# EAGLE design nRF-Remote (EAGLE 9.4.0)

## Sheet 1 of 2
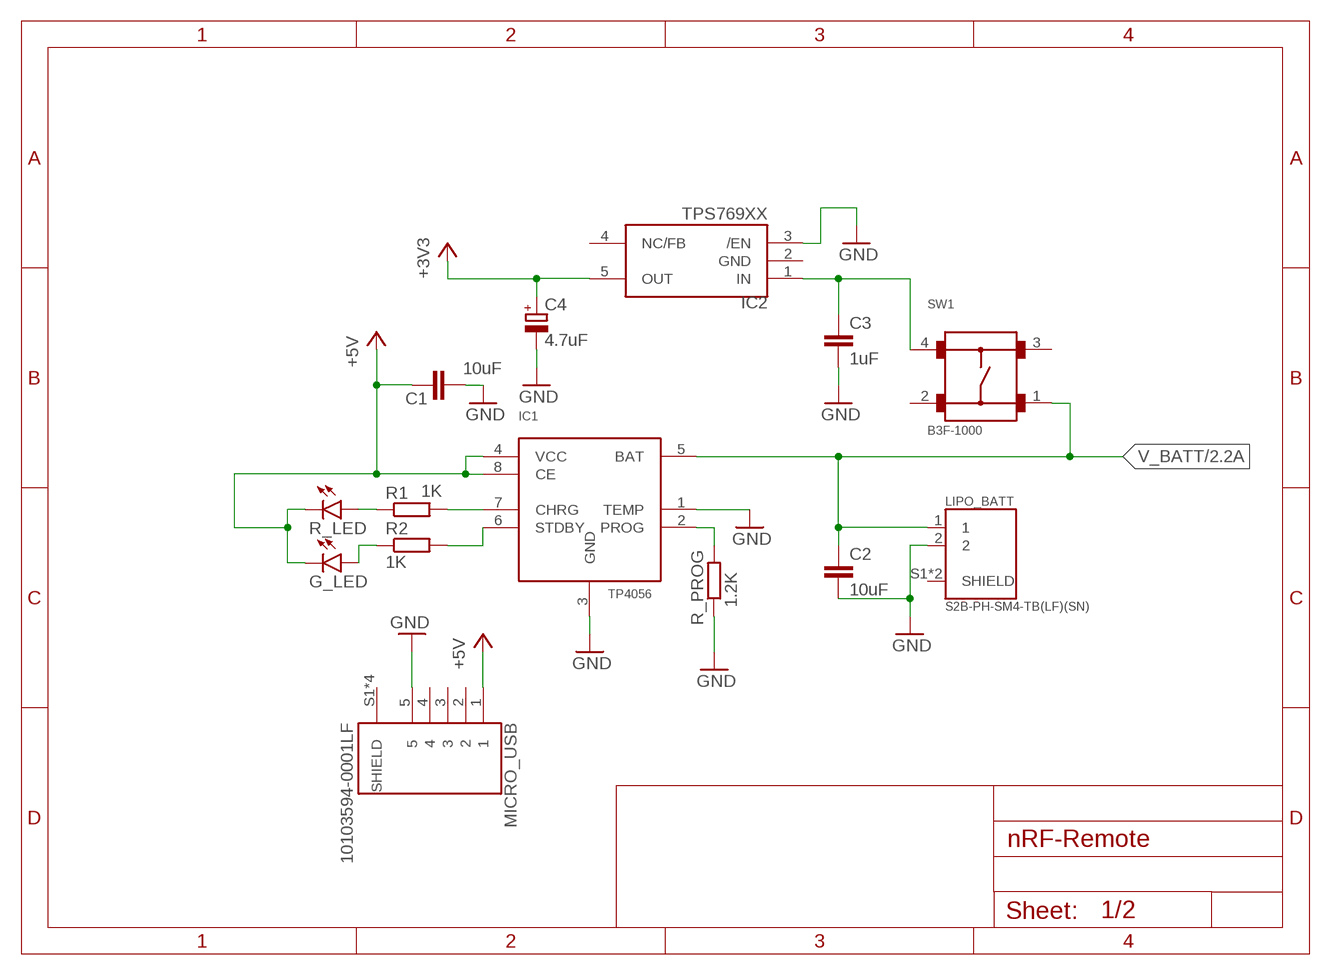
[diagram p0: schematic, sheet 1]

### Parts
C1  10uF  C-EUC0603  [C0603]
C2  10uF  C-EUC0603  [C0603]
C3  1uF  C-EUC0603  [C0603]
C4  4.7uF  CPOL-EU153CLV-0605  [153CLV-0605]
G_LED  LEDCHIP-LED0805  [CHIP-LED0805]
IC1  TP4056  [SOP-8]
IC2  TPS769XX  [SOT23-5L]
LIPO_BATT  S2B-PH-SM4-TB(LF)(SN)  [S2B-PH-SM4-TB(LF)(SN)]
MICRO_USB  10103594-0001LF  [10103594-0001LF]
R1  1K  R-EU_R0603  [R0603]
R2  1K  R-EU_R0603  [R0603]
R_LED  LEDCHIP-LED0805  [CHIP-LED0805]
R_PROG  1.2K  R-EU_R0603  [R0603]
SW1  B3F-1000  [B3F-1000]

### Nets
+3V3: C4.+ IC2.5(OUT) ; also sheet 2
+5V: C1.1 G_LED.C IC1.4(VCC) IC1.8(CE) MICRO_USB.1 R_LED.C
GND: C1.2 C2.2 C3.2 C4.- IC1.1(TEMP) IC1.3(GND) IC2.3(/EN) LIPO_BATT.2 MICRO_USB.5 R_PROG.1 ; also sheet 2
N$1: IC1.7(CHRG) R1.2
N$2: IC1.6(STDBY) R2.2
N$3: R1.1 R_LED.A
N$4: G_LED.A R2.1
N$6: IC1.2(PROG) R_PROG.2
N$7: C3.1 IC2.1(IN) SW1.4
V_BATT: C2.1 IC1.5(BAT) LIPO_BATT.1 SW1.1 ; also sheet 2
Unconnected: IC2.4(NC/FB) LIPO_BATT.S1(SHIELD) LIPO_BATT.S2(SHIELD) MICRO_USB.2 MICRO_USB.3 MICRO_USB.4 MICRO_USB.S1(SHIELD) MICRO_USB.S2(SHIELD) MICRO_USB.S3(SHIELD) MICRO_USB.S4(SHIELD) SW1.2 SW1.3

## Sheet 2 of 2
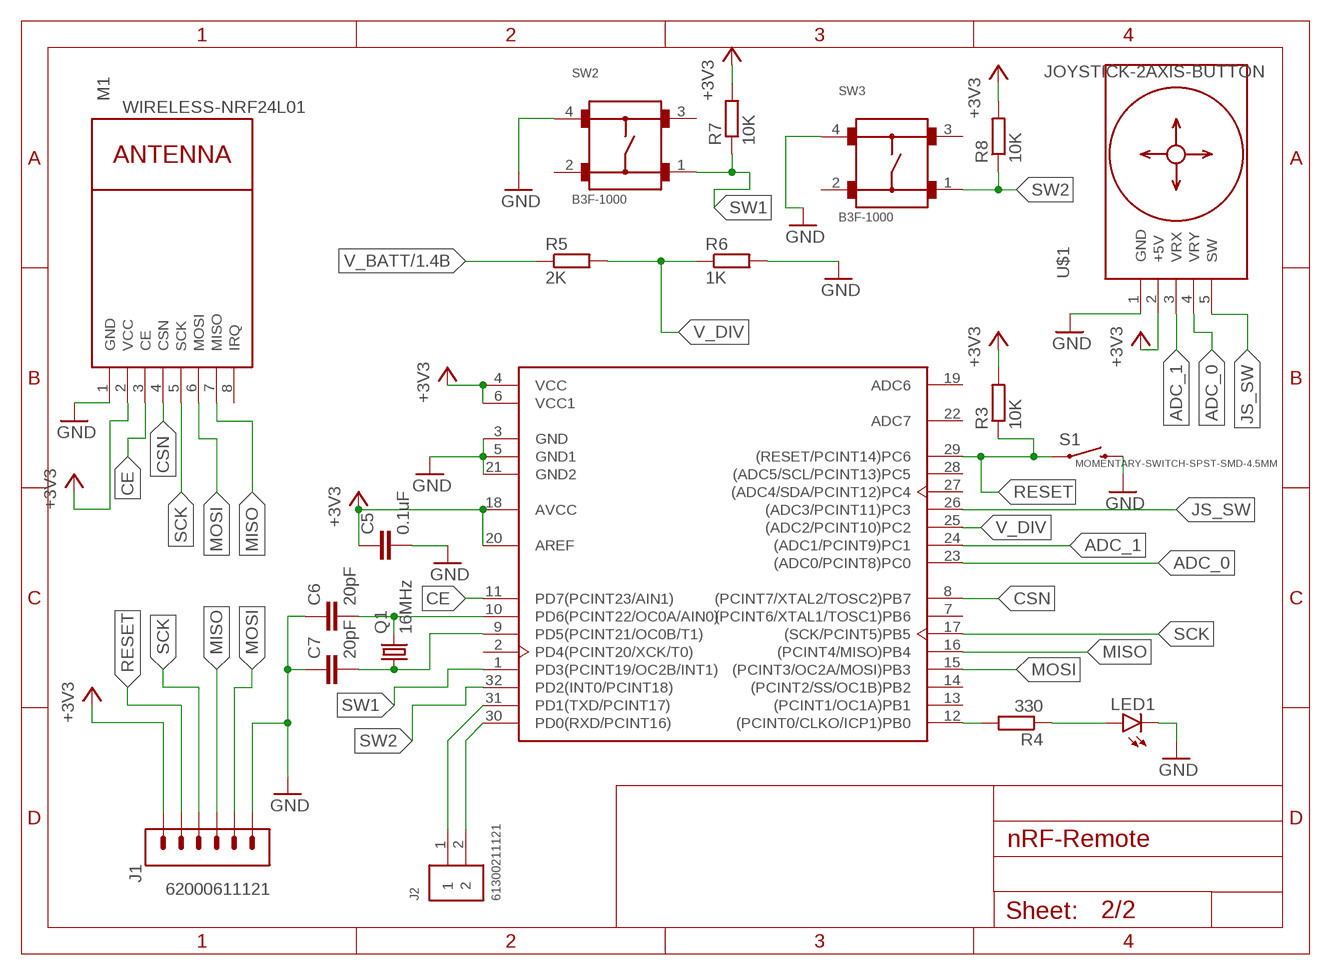
[diagram p1: schematic, sheet 2]

### Parts
C5  0.1uF  C-EUC0805  [C0805]
C6  20pF  C-EUC0603  [C0603]
C7  20pF  C-EUC0603  [C0603]
J1  62000611121  [62000611121]
J2  61300211121  [61300211121]
LED1  LEDCHIP-LED0805  [CHIP-LED0805]
M1  WIRELESS-NRF24L01  [WIRELESS-NRF24L01]
Q1  16MHz  CRYSTALSM49  [SM49]
R3  10K  R-EU_R0805  [R0805]
R4  330  R-EU_R0805  [R0805]
R5  2K  R-EU_R0805  [R0805]
R6  1K  R-EU_R0805  [R0805]
R7  10K  R-EU_R0603  [R0603]
R8  10K  R-EU_R0603  [R0603]
S1  MOMENTARY-SWITCH-SPST-SMD-4.5MM  [TACTILE_SWITCH_SMD_4.5MM]
SW2  B3F-1000  [B3F-1000]
SW3  B3F-1000  [B3F-1000]
U1  ATMEGA328P-AU  [TQFP-32]
U$1  JOYSTICK-2AXIS-BUTTON  [JOYSTICK-2AXIS-BUTTON]

### Nets
+3V3: C5.1 J1.1 M1.2(VCC) R3.2 R7.2 R8.2 U1.4(VCC) U1.6(VCC1) U1.18(AVCC) U1.20(AREF) U$1.2(+5V) ; also sheet 1
ADC_0: U1.23((ADC0/PCINT8)PC0) U$1.4(VRY)
ADC_1: U1.24((ADC1/PCINT9)PC1) U$1.3(VRX)
CE: M1.3(CE) U1.11(PD7(PCINT23/AIN1))
CSN: M1.4(CSN) U1.8((PCINT7/XTAL2/TOSC2)PB7)
GND: C5.2 C6.1 C7.1 J1.6 LED1.C M1.1(GND) R6.2 S1.1 S1.4 SW2.4 SW3.4 U1.3(GND) U1.5(GND1) U1.21(GND2) U$1.1(GND) ; also sheet 1
JS_SW: U1.26((ADC3/PCINT11)PC3) U$1.5(SW)
MISO: J1.4 M1.7(MISO) U1.16((PCINT4/MISO)PB4)
MOSI: J1.5 M1.6(MOSI) U1.15((PCINT3/OC2A/MOSI)PB3)
N$5: R4.2 U1.12((PCINT0/CLKO/ICP1)PB0)
N$8: C6.2 Q1.2 U1.10(PD6(PCINT22/OC0A/AIN0))
N$9: LED1.A R4.1
N$10: C7.2 Q1.1 U1.9(PD5(PCINT21/OC0B/T1))
N$15: J2.2 U1.30(PD0(RXD/PCINT16))
N$16: J2.1 U1.31(PD1(TXD/PCINT17))
RESET: J1.2 R3.1 S1.2 S1.3 U1.29((RESET/PCINT14)PC6)
SCK: J1.3 M1.5(SCK) U1.17((SCK/PCINT5)PB5)
SW1: R7.1 SW2.1 U1.1(PD3(PCINT19/OC2B/INT1))
SW2: R8.1 SW3.1 U1.32(PD2(INT0/PCINT18))
V_BATT: R5.1 ; also sheet 1
V_DIV: R5.2 R6.1 U1.25((ADC2/PCINT10)PC2)
Unconnected: M1.8(IRQ) SW2.2 SW2.3 SW3.2 SW3.3 U1.2(PD4(PCINT20/XCK/T0)) U1.7((PCINT6/XTAL1/TOSC1)PB6) U1.13((PCINT1/OC1A)PB1) U1.14((PCINT2/SS/OC1B)PB2) U1.19(ADC6) U1.22(ADC7) U1.27((ADC4/SDA/PCINT12)PC4) U1.28((ADC5/SCL/PCINT13)PC5)

## Power pins joined to a net without a drawn wire
GND: IC2.2(GND)

## Library data of the parts
C1-C3 C5 = resistor:C-EU: CAPACITOR, European symbol
C4 = resistor:CPOL-EU: POLARIZED CAPACITOR, European symbol
C6 C7 = rcl:C-EU: CAPACITOR, European symbol; SPICEPREFIX: C
G_LED LED1 R_LED = led:LED: LED OSRAM: - CHIPLED LG R971, LG N971, LY N971, LG Q971, LY Q971, LO R971, LY R971 LH N974, LH R974 LS Q976, LO Q976, LY Q976 LO Q996 - Hyper CHIPLED LW Q18S LB Q993, LB Q99A, LB R99A - SideLED LS A670, LO A670, LY A670, LG A670, LP A670 LB A673, LV A673, LT A673, LW A673 LH A674 LY A675 LS A676, LA A676, LO A676, LY A676, LW A676 LS A679, LY A679, LG A679 - Hyper Micro SIDELED® LS Y876, LA Y876, LO Y876, LY Y876 LT Y87S - SmartLED LW L88C, LW L88S LB L89C, LB L89S, LG L890 LS L89K, LO L89K, LY L89K LS L896, LA L896, LO L896, LY L896 - TOPLED LS T670, LO T670, LY T670, LG T670, LP T670 LSG T670, LSP T670, LSY T670, LOP T670, LYG T670 LG T671, LOG T671, LSG T671 LB T673, LV T673, LT T673, LW T673 LH T674 LS T676, LA T676, LO T676, LY T676, LB T676, LH T676, LSB T676, LW T676 LB T67C, LV T67C, LT T67C, LS T67K, LO T67K, LY T67K, LW E67C LS E67B, LA E67B, LO E67B, LY E67B, LB E67C, LV E67C, LT E67C LW T67C LS T679, LY T679, LG T679 LS T770, LO T770, LY T770, LG T770, LP T770 LB T773, LV T773, LT T773, LW T773 LH T774 LS E675, LA E675, LY E675, LS T675 LS T776, LA T776, LO T776, LY T776, LB T776 LHGB T686 LT T68C, LB T68C - Hyper Mini TOPLED® LB M676 - Mini TOPLED Santana® LG M470 LS M47K, LO M47K, LY M47K Source: http://www.osram.convergy.de LUXEON: - LUMILED® LXK2-PW12-R00, LXK2-PW12-S00, LXK2-PW14-U00, LXK2-PW14-V00 LXK2-PM12-R00, LXK2-PM12-S00, LXK2-PM14-U00 LXK2-PE12-Q00, LXK2-PE12-R00, LXK2-PE12-S00, LXK2-PE14-T00, LXK2-PE14-U00 LXK2-PB12-K00, LXK2-PB12-L00, LXK2-PB12-M00, LXK2-PB14-N00, LXK2-PB14-P00, LXK2-PB14-Q00 LXK2-PR12-L00, LXK2-PR12-M00, LXK2-PR14-Q00, LXK2-PR14-R00 LXK2-PD12-Q00, LXK2-PD12-R00, LXK2-PD12-S00 LXK2-PH12-R00, LXK2-PH12-S00 LXK2-PL12-P00, LXK2-PL12-Q00, LXK2-PL12-R00 Source: www.luxeon.com KINGBRIGHT: KA-3528ASYC Source: www.kingbright.com
IC1 = TP4056:TP4056; AVAILABILITY: Unavailable; MF: NanJing Top Power ASIC Corp.; MP: TP4056; PACKAGE: Package Analog Devices; PRICE: None
IC2 = tps769xx:TPS769XX
J1 = Headers:62000611121: THT Vertical Pin Header WR-PHD, Pitch 2.00 mm, Single Row, 6 pins Manufacturer's datasheet <https://datasheet.octopart.com/62000611121-W%C3%BCrth-Elektronik-datasheet-117282008.pdf>; CREATED_BY: PCBLayout.com; MANUFACTURER: Würth Elektronik; MPN: 62000611121
J2 = Headers:61300211121: CONN HEADER VERT 2POS 2.54MM Manufacturer's datasheet <https://katalog.we-online.de/em/datasheet/6130xx11121.pdf>; CREATED_BY: PCBLayout.com; DIGI_KEY_PART_NUMBER: 732-5315-ND; MANUFACTURER: Wurth Electronics Inc.; MPN: 61300211121
LIPO_BATT = Connectors:S2B-PH-SM4-TB(LF)(SN): CONN HEADER SMD R/A 2POS 2MM Manufacturer's datasheet <http://www.jst-mfg.com/product/pdf/eng/ePH.pdf>; CREATED_BY: PCBLayout.com; DIGI_KEY_PART_NUMBER: 455-1749-1-ND; MANUFACTURER: JST Sales America Inc.; MPN: S2B-PH-SM4-TB(LF)(SN); PACKAGE: SMD
M1 = diy-modules:WIRELESS-NRF24L01: 2.4 GHz Wireless Module based on NRF24L01 chip More details available here: http://www.electrodragon.com/w/NRF24L01 Click here to find device on ebay.com <http://www.ebay.com/sch/nrf24l01+arduino>
MICRO_USB = Connectors:10103594-0001LF: CONN RCPT USB2.0 MICRO B SMD R/A Manufacturer's datasheet <https://cdn.amphenol-icc.com/media/wysiwyg/files/drawing/10103594.pdf>; CREATED_BY: PCBLayout.com; DIGIKEY_PART_NUMBER: 609-4050-2-ND; MANUFACTURER: Amphenol ICC (FCI); MPN: 10103594-0001LF
Q1 = adafruit:CRYSTAL: CRYSTAL; OC_FARNELL: unknown; OC_NEWARK: unknown
R1-R6 R_PROG = resistor:R-EU_: RESISTOR, European symbol
R7 R8 = rcl:R-EU_: RESISTOR, European symbol; SPICEPREFIX: R
S1 = SparkFun-Switches:MOMENTARY-SWITCH-SPST: Momentary Switch (Pushbutton) - SPST Normally-open (NO) SPST momentary switches (buttons, pushbuttons). Variants PTH-12MM - 12mm square, through-hole Momentary Pushbutton Switch - 12mm Square <https://www.sparkfun.com/products/9190> (COM-09190) PTH-6.0MM, PTH-6.0MM-KIT - 6.0mm square, through-hole Mini Pushbutton Switch <https://www.sparkfun.com/products/97> (COM-00097) KIT package intended for soldering kit's - only one side of pads' copper is exposed. PTH-RIGHT-ANGLE-KIT - Right-angle, through-hole Right Angle Tactile Button <https://www.sparkfun.com/products/10791> - Used on SparkFun BigTime Watch Kit <https://www.sparkfun.com/products/11734> SMD-12MM - 12mm square, surface-mount Tactile Button - SMD (12mm) <https://www.sparkfun.com/products/12993> (COM-12993) Used on SparkFun PicoBoard <https://www.sparkfun.com/products/11888> SMD-4.5MM - 4.5mm Square Trackball Switch Used on SparkFun Blackberry Trackballer Breakout <https://www.sparkfun.com/products/13169> SMD-4.6MMX2.8MM - 4.60mm x 2.80mm, surface mount Used on SparkFun SAMD21 Mini Breakout <https://www.sparkfun.com/products/13664> SMD-5.2MM, SMD-5.2-REDUNDANT - 5.2mm square, surface-mount Mini Pushbutton Switch - SMD <https://www.sparkfun.com/products/8720> (COM-08720) Used on Arduino Pro Mini <https://www.sparkfun.com/products/11114> REDUNDANT package connects both switch circuits together SMD-6.0X3.5MM - 6.0 x 3.5mm, surface mount Momentary Reset Switch SMD <https://www.sparkfun.com/products/8229> (COM-08229) SMD-6.2MM-TALL - 6.2mm square, surface mount Tactile Button - SMD (6mm) <https://www.sparkfun.com/products/12992> Used on SparkFun Digital Sandbox <https://www.sparkfun.com/products/12651> SMD-RIGHT-ANGLE - Right-angle, surface mount Used on SparkFun Block for Intel® Edison - Arduino <https://www.sparkfun.com/products/13036>; PROD_ID: SWCH-09213
SW1-SW3 = Switch:B3F-1000: Tactile Switch SPST-NO Top Actuated Through Hole Manufacturer's datasheet <https://omronfs.omron.com/en_US/ecb/products/pdf/en-b3f.pdf>; CREATED_BY: PCBLayout.com; DIGI_KEY_PART_NUMBER: SW400-ND; MANUFACTURER: Omron Electronics Inc-EMC Div; MPN: B3F-1000; PACKAGE: SPST-NO
U1 = Microcontroller:ATMEGA328P-AU: IC MCU 8BIT 32KB FLASH 32TQFP Manufacturer's datasheet <http://ww1.microchip.com/downloads/en/DeviceDoc/ATmega48A-PA-88A-PA-168A-PA-328-P-DS-DS40002061A.pdf>; CREATED_BY: PCBLayout.com; DIGIKEY_PART_NUMBER: ATMEGA328P-AU-ND; MANUFACTURER: Microchip Technology; MPN: ATMEGA328P-AU; PACKAGE: TQFP-32
U$1 = diy-modules:JOYSTICK-2AXIS-BUTTON: 2-Axis Analog Joystick with Push Button Tutorial is available here: http://henrysbench.capnfatz.com/henrys-bench/arduino-sensors-and-input/arduino-ps2-joystick-tutorial-keyes-ky-023-deek-robot/ Click here to find device on ebay.com <http://www.ebay.com/sch/joystick+ps2+module>

## Board
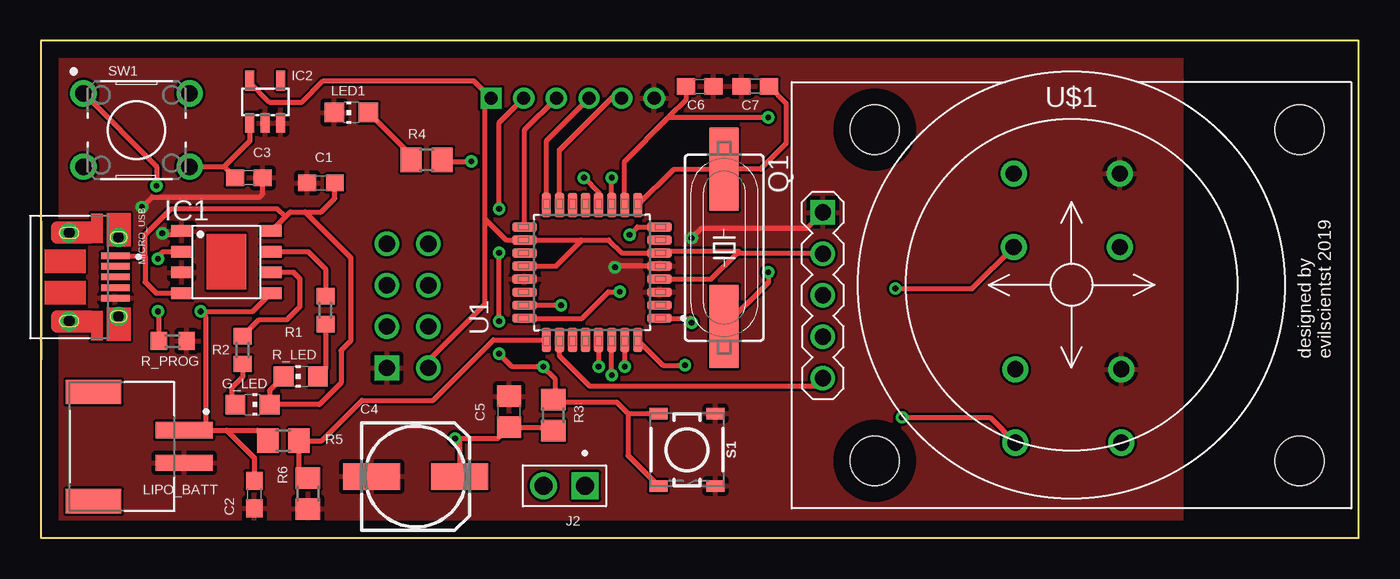
[diagram p2: board, top side]
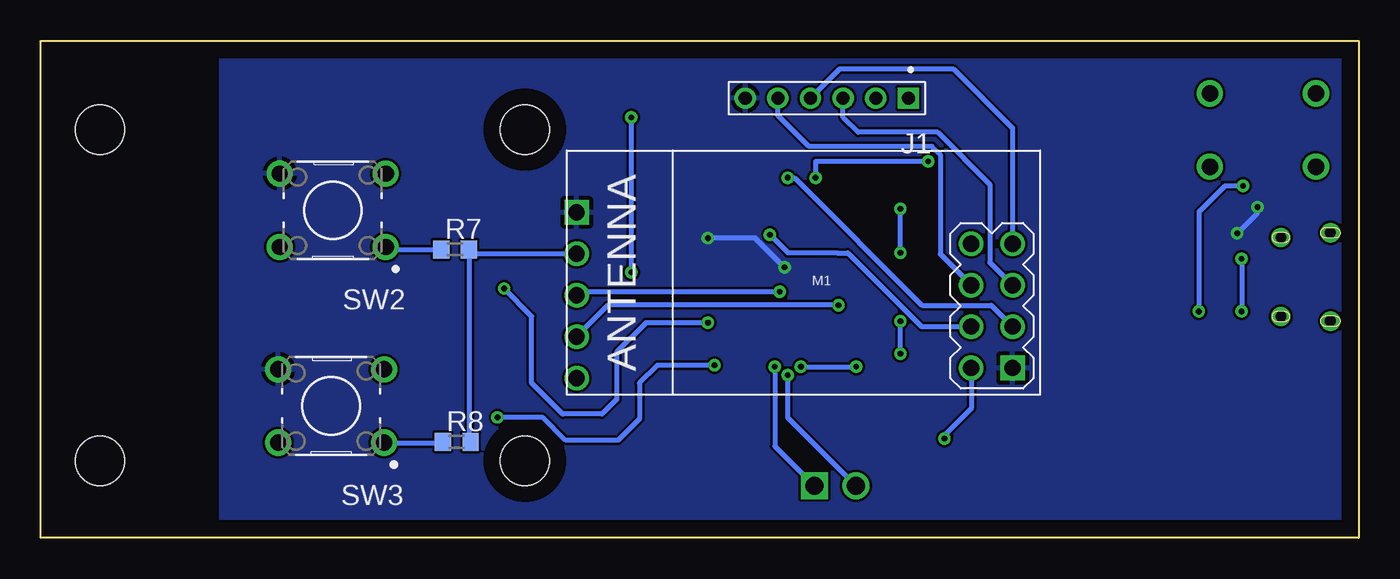
[diagram p3: board, bottom side, seen from below]

Size 80.8 x 30.5 mm. Coordinates in mm from the lower left corner, seen from the top.
Outline: 0,0 80.8,0 80.8,30.5 0,30.5 0,0
Copper layers (1*16): Top 0.035mm / dielectric 1.5mm / Bottom 0.035mm
Design rules "default": minimum track width 6mil, minimum drill 0.35mm, track to track 6mil, track to pad 6mil, pad to pad 6mil, via to via 6mil, smd to smd 6mil, copper to edge 40mil, drill to drill 6mil, minimum pad ring 10mil, minimum via ring 8mil, stop-mask expansion 4mil, vias tented up to drill 0mil, thermal gap 10mil

### Footprints (pad centres in the part's own frame; a part is rotated, then mirrored left to right if it is on the bottom)
C0603 = smd 1.1 x 1: 1 -0.85,0; 2 0.85,0
153CLV-0605 = smd 3.5 x 1.6: + 2.7,0; - -2.7,0
C0805 = smd 1.3 x 1.5: 1 -0.95,0; 2 0.95,0
CHIP-LED0805 = smd 1.2 x 1.2: A 0,-1.05; C 0,1.05
SOP-8 = smd 1.3 x 0.7: 1 -2.75,1.905; 2 -2.75,0.635; 3 -2.75,-0.635; 4 -2.75,-1.905; 5 2.75,-1.905; 6 2.75,-0.635; 7 2.75,0.635; 8 2.75,1.905
SOT23-5L = smd 0.55 x 1.2: 1 -0.95,-1.3; 2 0,-1.3; 3 0.95,-1.3; 4 0.95,1.3; 5 -0.95,1.3
62000611121 = drill 0.8 square: 1 -5,0 | drill 0.8: 2 -3,0; 3 -1,0; 4 1,0; 5 3,0; 6 5,0
61300211121 = drill 1.1 square: 1 -1.27,0 | drill 1.1: 2 1.27,0
S2B-PH-SM4-TB(LF)(SN) = smd 1 x 3.5: 1 -1,0; 2 1,0 | smd 1.5 x 3.4: S1 -3.35,-5.55; S2 3.35,-5.55
WIRELESS-NRF24L01 = drill 1 square: 1 -12.7,6.35 | drill 1: 2 -10.16,6.35; 3 -12.7,3.81; 4 -10.16,3.81; 5 -12.7,1.27; 6 -10.16,1.27; 7 -12.7,-1.27; 8 -10.16,-1.27
10103594-0001LF = smd 0.4 x 1.75: 1 -1.3,2.825; 2 -0.65,2.825; 3 0,2.825; 4 0.65,2.825; 5 1.3,2.825 | drill 0.65 pad 1.05: S1 -2.425,3.03; S2 2.425,3.03 | drill 0.66 pad 1.2: S3 -2.705,0; S4 2.705,0
SM49 = smd 5.08 x 1.778: 1 -4.826,0; 2 4.826,0
R0603 = smd 1 x 1.1: 1 -0.85,0; 2 0.85,0
R0805 = smd 1.3 x 1.5: 1 -0.95,0; 2 0.95,0
TACTILE_SWITCH_SMD_4.5MM = smd 0.7 x 1.1: 1 2.225,1.75; 2 2.225,-1.75; 3 -2.225,-1.75; 4 -2.225,1.75
B3F-1000 = drill 1 pad 1.6: 1 -3.25,2.25; 2 3.25,2.25; 3 -3.25,-2.25; 4 3.25,-2.25
TQFP-32 = smd 0.57 x 1.5: 1 -2.8,-4.13; 2 -2,-4.13; 3 -1.2,-4.13; 4 -0.4,-4.13; 5 0.4,-4.13; 6 1.2,-4.13; 7 2,-4.13; 8 2.8,-4.13; 17 2.8,4.13; 18 2,4.13; 19 1.2,4.13; 20 0.4,4.13; 21 -0.4,4.13; 22 -1.2,4.13; 23 -2,4.13; 24 -2.8,4.13 | smd 1.5 x 0.57: 9 4.13,-2.8; 10 4.13,-2; 11 4.13,-1.2; 12 4.13,-0.4; 13 4.13,0.4; 14 4.13,1.2; 15 4.13,2; 16 4.13,2.8; 25 -4.13,2.8; 26 -4.13,2; 27 -4.13,1.2; 28 -4.13,0.4; 29 -4.13,-0.4; 30 -4.13,-1.2; 31 -4.13,-2; 32 -4.13,-2.8
JOYSTICK-2AXIS-BUTTON = drill 1 square: 1 -15.24,5.08 | drill 1: 2 -15.24,2.54; 3 -15.24,0; 4 -15.24,-2.54; 5 -15.24,-5.08 | hole 3: -12.065,10.16; -12.065,-10.16; 13.97,-10.16; 13.97,10.16

### Placement (x,y rotation side)
C1  17.18,21.78 180 top
C2  13.09,2.67 270 top
C3  12.76,22.1 0 top
C4  22.98,3.77 0 top
C5  28.71,7.75 90 top
C6  40.4,27.7 180 top
C7  43.8,27.7 0 top
G_LED  12.98,8.19 270 top
IC1  11.38,16.93 0 top
IC2  13.76,26.75 0 top
J1  32.61,26.98 180 bottom
J2  32.1,3.2 180 top
LED1  19.04,26.1 90 top
LIPO_BATT  8.79,5.61 270 top
M1  33.92,16.78 180 bottom
MICRO_USB  1.74,16.01 270 top
Q1  41.9,17.8 270 top
R1  17.46,13.97 90 top
R2  12.38,11.53 90 top
R3  31.42,7.53 270 top
R4  23.65,23.2 0 top
R5  14.87,5.97 0 top
R6  16.39,2.73 270 top
R7  55.4,17.7 0 bottom
R8  55.3,5.9 0 bottom
R_LED  15.94,9.91 90 top
R_PROG  8.09,12.08 180 top
S1  39.62,5.41 270 top
SW1  5.87,25.02 0 top
SW2  62.9,20.1 180 bottom
SW3  63,8.1 180 bottom
U1  33.8,16.28 90 top
U$1  63.19,14.89 0 top

### Tracks (layer width: path | path; a pad name or v marks a point on that pad's centre or on a via)
+3V3  (via drill 0.35)
  Top 0.3: U$1.2 48,17.48 42.7,17.48 | 42.7,17.48 41.1,15.88 U1.4 | 42.7,17.48 42.8,17.58 38.03,17.58 U1.6 35.62,17.48 34.82,18.28 33.1,18.28 | R3.2 31.2,6.8 C5.1 28.01,6.1 v25.4,6.1 25.68,5.82 C4.+ | 33.1,18.28 U1.18 28.53,18.28 27.21,19.6 | U1.20 31.6,16.68 33.1,18.18 33.1,18.28 | 27.21,19.6 27.21,26.58 J1.1 26.54,28.05 17.31,28.05 16.01,26.75 14.01,26.75 12.81,27.95 IC2.5 | 27.21,19.6 27.21,14.31 23.76,10.86 M1.2
  Bottom 0.3: M1.2 23.76,7.94 25.4,6.3 v25.4,6.1 | R8.2 54.55,6 R7.2 54.28,17.43 U$1.2
+5V
  Top 0.3: IC1.8 15,19.7 | 15,19.7 15.29,20 16.2,20 | 16.2,20 17.2,20 18.03,20.83 C1.1 | MICRO_USB.1 6.39,17.31 6.4,17.3 | 6.4,17.3 6.4,18.6 8,20.2 14.5,20.2 15,19.7 | 6.4,17.3 6.4,15.7 7.08,15.03 IC1.4 | R_LED.C 14.03,9.05 G_LED.C 17.09,8.19 18.4,9.5 18.4,11.5 19,12.1 19,17.2 16.2,20
ADC_0  (via drill 0.35)
  Top 0.3: U1.23 v31.9,14.28
  Bottom 0.3: v31.9,14.28 46.02,14.28 U$1.4
ADC_1  (via drill 0.35)
  Top 0.3: v35.5,15.1 34.8,15.1 33.18,13.48 U1.24
  Bottom 0.3: v35.5,15.1 47.74,15.1 U$1.3
CE  (via drill 0.35)
  Top 0.3: U1.11 v35,22.1
  Bottom 0.3: M1.3 22.52,14.27 26.77,14.27 34.6,22.1 v35,22.1
CSN  (via drill 0.35)
  Top 0.3: v36.1,18.6 36.58,19.08 U1.8
  Bottom 0.3: v36.1,18.6 35,17.5 32,17.5 31.98,17.48 31.32,17.48 26.81,12.97 M1.4
GND  (via drill 0.35)
  Top 0.3: U1.5 35.28,16.68 v35.2,16.6 | IC1.1 8.38,18.59 7.55,18.59 v7.45,18.69 | v6.2,20.3 6.82,20.92 13.42,20.92 13.61,21.11 C3.2 | v39.9,18.4 40.5,19 46.98,19 U$1.1
  Bottom 0.3: v35.2,16.6 37,18.4 v39.9,18.4 | v7.45,18.69 6.2,19.93 v6.2,20.3
  pour Top: 0.3,30.1 69.9,30.1 69.9,0.2 0.3,0.2
  pour Bottom: 0,29.9 0,0 69.7,0 69.7,29.8 0.2,29.8 0.1,29.9
JS_SW
  Top 0.3: U$1.5 47.45,9.31 33.66,9.31 31.8,11.17 U1.26
MISO
  Top 0.3: U1.16 31,24.37 J1.4
  Bottom 0.3: J1.4 31.81,28.78 24.85,28.78 21.22,25.15 M1.7
MOSI
  Top 0.3: U1.15 31.8,23.8 34.98,26.98 J1.5
  Bottom 0.3: M1.6 25.66,17.41 25.66,23.51 26.16,24.01 33.7,24.01 35.61,25.92 J1.5
N$1
  Top 0.3: IC1.7 16.4,17.57 17.46,16.5 R1.2
N$2
  Top 0.3: IC1.6 15.51,16.3 15.9,15.9 15.9,14.2 15.1,13.4 13.4,13.4 R2.2
N$3
  Top 0.3: R_LED.A 17.46,10.38 R1.1
N$4
  Top 0.3: R2.1 12.38,9.88 11.7,9.2 11.7,8.42 G_LED.A
N$5  (via drill 0.35)
  Top 0.3: R4.2 24.7,23.1 v26.4,23.1 | v33.3,22.1 34.2,21.2 U1.12
  Bottom 0.3: v26.4,23.1 33.3,23.1 v33.3,22.1
N$6  (via drill 0.35)
  Top 0.3: v7.18,17.12 7.18,17.25 7.5,17.57 IC1.2 | v7.18,13.9 7.24,13.84 R_PROG.2
  Bottom 0.3: v7.18,17.12 v7.18,13.9
N$7
  Top 0.3: SW1.4 11.24,22.77 | 11.24,22.77 C3.1 | IC2.1 12.81,24.34 11.24,22.77
N$8  (via drill 0.35)
  Top 0.3: U1.10 35.8,23.1 38.5,25.8 | 38.5,25.8 v44.6,25.8 | v44.6,16.3 44.6,15.67 Q1.2 | C6.2 39.55,26.85 38.5,25.8
  Bottom 0.3: v44.6,25.8 v44.6,16.3
N$9
  Top 0.3: LED1.A 22.7,23.49 R4.1
N$10
  Top 0.3: U1.9 38.82,22.63 Q1.1 44.13,22.63 45.7,24.2 45.7,26.65 C7.2
N$15  (via drill 0.35)
  Top 0.3: v35,9.99 U1.30
  Bottom 0.3: J2.2 35,7.37 v35,9.99
N$16  (via drill 0.35)
  Top 0.3: U1.31 v35.8,10.5
  Bottom 0.3: v35.8,10.5 35.8,5.63 J2.1
RESET  (via drill 0.35)
  Top 0.3: U1.29 v34.2,10.5 | v28.1,11.3 28.9,10.5 v30.8,10.5 31.52,9.78 31.52,8.58 R3.1 31.57,8.34 35.3,8.34 36,7.63 | v28.1,13.3 v28.1,17.5 | J1.2 28.1,25.47 v28.1,20.2 | S1.2 36,5.05 36,7.63 | 36,7.63 S1.3
  Bottom 0.3: v34.2,10.5 v30.8,10.5 | v28.1,11.3 v28.1,13.3 | v28.1,17.5 v28.1,20.2
SCK
  Top 0.3: U1.17 29.67,25.04 J1.3
  Bottom 0.3: M1.5 22.62,16.91 22.62,21.69 25.81,24.88 30.7,24.88 31.61,25.79 J1.3
SW1  (via drill 0.35)
  Top 0.3: U1.1 39.82,13.48 39.9,13.4 v39.9,13.2 | v52.4,15.3 57.1,15.3 SW2.1
  Bottom 0.3: SW2.1 59.5,17.7 R7.1 | v39.9,13.2 43.7,13.2 45.5,11.4 45.5,8.5 46.4,7.6 48.8,7.6 50.7,9.5 50.7,13.6 v52.4,15.3
SW2  (via drill 0.35)
  Top 0.3: U1.32 38.15,10.6 v39.5,10.6 | v52.8,7.4 58.2,7.4 SW3.1
  Bottom 0.3: SW3.1 56.2,5.85 R8.1 | v39.5,10.6 43,10.6 44.1,9.5 44.1,7.3 45.4,6 48.62,6 50.02,7.4 v52.8,7.4
V_BATT  (via drill 0.35)
  Top 0.3: 8.89,6.71 LIPO_BATT.1 10.1,6.61 | SW1.1 7.1,22.79 v7.1,21.6 | 10.1,6.61 11.4,6.61 | 11.4,6.61 13.28,6.61 R5.1 | 11.4,6.61 13.09,4.92 C2.1 | IC1.5 13.01,13.9 v9.8,13.9 10.1,13.6 10.1,6.61
  Bottom 0.3: v7.1,21.6 8.2,21.6 9.8,20 v9.8,13.9
V_DIV
  Top 0.3: R6.1 15.82,4.25 R5.2 17.22,5.97 19.7,8.45 24.05,8.45 27.75,12.15 U1.25

### Text on the board
tNames: designed by / evilscientst 2019